# Altium schematic sheet MB_ZBT_memory.SchDoc
size A
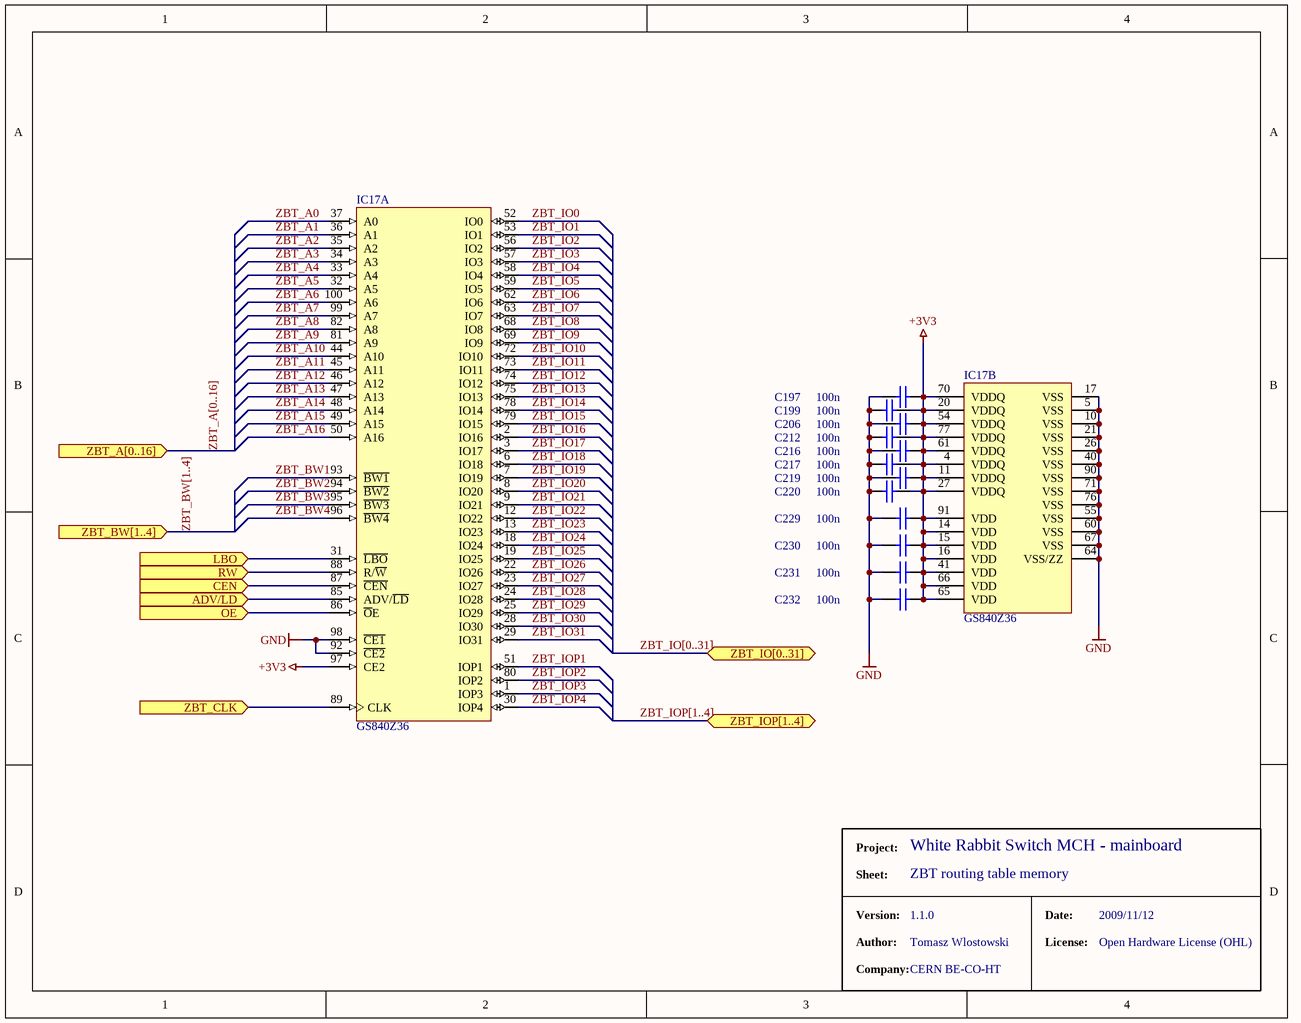
[diagram p0: MB_ZBT_memory.SchDoc]

## Parts
C197  100n  [CAPC1005X55N]
C199  100n  [CAPC1005X55N]
C206  100n  [CAPC1005X55N]
C212  100n  [CAPC1005X55N]
C216  100n  [CAPC1005X55N]
C217  100n  [CAPC1005X55N]
C219  100n  [CAPC1005X55N]
C220  100n  [CAPC1005X55N]
C229  100n  [CAPC1005X55N]
C230  100n  [CAPC1005X55N]
C231  100n  [CAPC1005X55N]
C232  100n  [CAPC1005X55N]
IC17  GS840Z36  [TQFP100A101]  (parts A,B of 2)

## Ports
ADV/LD (in), CEN (in), LBO (in), OE (in), RW (in), ZBT_A[0..16] (in), ZBT_BW[1..4] (in), ZBT_CLK (in), ZBT_IO[0..31] (bidir), ZBT_IOP[1..4] (bidir)

## Nets
+3V3: C197.2 C199.2 C206.2 C212.2 C216.2 C217.2 C219.2 C220.2 C229.2 C230.2 C231.2 C232.2 IC17.4(VDDQ) IC17.11(VDDQ) IC17.14(VDD) IC17.15(VDD) IC17.16(VDD) IC17.20(VDDQ) IC17.27(VDDQ) IC17.41(VDD) IC17.54(VDDQ) IC17.61(VDDQ) IC17.65(VDD) IC17.66(VDD) IC17.70(VDDQ) IC17.77(VDDQ) IC17.91(VDD) IC17.97(CE2)
GND: C197.1 C199.1 C206.1 C212.1 C216.1 C217.1 C219.1 C220.1 C229.1 C230.1 C231.1 C232.1 IC17.5(VSS) IC17.10(VSS) IC17.17(VSS) IC17.21(VSS) IC17.26(VSS) IC17.40(VSS) IC17.55(VSS) IC17.60(VSS) IC17.64(VSS/ZZ) IC17.67(VSS) IC17.71(VSS) IC17.76(VSS) IC17.90(VSS) IC17.92(~{CE2}) IC17.98(~{CE1})
ADV/LD: IC17.85(ADV/~{LD}) ; port ADV/LD
CEN: IC17.87(~{CEN}) ; port CEN
LBO: IC17.31(~{LBO}) ; port LBO
OE: IC17.86(~{O}E) ; port OE
RW: IC17.88(R/~{W}) ; port RW
ZBT_A0: IC17.37(A0)
ZBT_A1: IC17.36(A1)
ZBT_A2: IC17.35(A2)
ZBT_A3: IC17.34(A3)
ZBT_A4: IC17.33(A4)
ZBT_A5: IC17.32(A5)
ZBT_A6: IC17.100(A6)
ZBT_A7: IC17.99(A7)
ZBT_A8: IC17.82(A8)
ZBT_A9: IC17.81(A9)
ZBT_A10: IC17.44(A10)
ZBT_A11: IC17.45(A11)
ZBT_A12: IC17.46(A12)
ZBT_A13: IC17.47(A13)
ZBT_A14: IC17.48(A14)
ZBT_A15: IC17.49(A15)
ZBT_A16: IC17.50(A16)
ZBT_BW1: IC17.93(~{BW1})
ZBT_BW2: IC17.94(~{BW2})
ZBT_BW3: IC17.95(~{BW3})
ZBT_BW4: IC17.96(~{BW4})
ZBT_CLK: IC17.89(CLK) ; port ZBT_CLK
ZBT_IO0: IC17.52(IO0)
ZBT_IO1: IC17.53(IO1)
ZBT_IO2: IC17.56(IO2)
ZBT_IO3: IC17.57(IO3)
ZBT_IO4: IC17.58(IO4)
ZBT_IO5: IC17.59(IO5)
ZBT_IO6: IC17.62(IO6)
ZBT_IO7: IC17.63(IO7)
ZBT_IO8: IC17.68(IO8)
ZBT_IO9: IC17.69(IO9)
ZBT_IO10: IC17.72(IO10)
ZBT_IO11: IC17.73(IO11)
ZBT_IO12: IC17.74(IO12)
ZBT_IO13: IC17.75(IO13)
ZBT_IO14: IC17.78(IO14)
ZBT_IO15: IC17.79(IO15)
ZBT_IO16: IC17.2(IO16)
ZBT_IO17: IC17.3(IO17)
ZBT_IO18: IC17.6(IO18)
ZBT_IO19: IC17.7(IO19)
ZBT_IO20: IC17.8(IO20)
ZBT_IO21: IC17.9(IO21)
ZBT_IO22: IC17.12(IO22)
ZBT_IO23: IC17.13(IO23)
ZBT_IO24: IC17.18(IO24)
ZBT_IO25: IC17.19(IO25)
ZBT_IO26: IC17.22(IO26)
ZBT_IO27: IC17.23(IO27)
ZBT_IO28: IC17.24(IO28)
ZBT_IO29: IC17.25(IO29)
ZBT_IO30: IC17.28(IO30)
ZBT_IO31: IC17.29(IO31)
ZBT_IOP1: IC17.51(IOP1)
ZBT_IOP2: IC17.80(IOP2)
ZBT_IOP3: IC17.1(IOP3)
ZBT_IOP4: IC17.30(IOP4)

## Buses and harness runs
bus ZBT_A[0..16] = port ZBT_A[0..16]
bus ZBT_BW[1..4] = port ZBT_BW[1..4]
bus ZBT_IO[0..31] = port ZBT_IO[0..31]
bus ZBT_IOP[1..4] = port ZBT_IOP[1..4]

## Notes on the sheet
- Project:
- Sheet:
- ZBT routing table memory
- White Rabbit Switch MCH - mainboard
- Version:
- Author:
- Company:
- 1.1.0
- Tomasz Wlostowski
- CERN BE-CO-HT
- Date:
- License:
- 2009/11/12
- Open Hardware License (OHL)

## Library data of the parts
C197 C199 C206 C212 C216 C217 C219 C220 C229-C232 = CC0402_100NF_16V_10%_X7R: Non-polarised capacitor; Part Description: SMD Multilayer Chip Ceramic Capacitor; Manufacturer: GENERIC; Manufacturer1 Part Number: 223878715649; Manufacturer1 Datasheet: \\cern.ch\dfs\Applications\Altium\Datasheets\CC0402_X7R_PHYCOMP.pdf; Value: 100nF; Voltage: 16V; TC: X7R; Tolerance: ±10%; Table: Capacitors SMD; Part Number: CC0402_100NF_16V_10%_X7R; Component Kind: Standard; Component Type: Standard; Designator: Capacitor - non polarized; Library Reference: Capacitor - non polarized; Pin Count: 2; Status: Not Recommended; Manufacturer Part Number: CC0402_100NF_16V_10%_X7R; Case: 0402; Mounted: Yes; Socket: No; SMD: Yes; Manufacturer1 Example: PHYCOMP; Manufacturer1 ComponentHeight: 0.55mm; HelpURL: \\cern.ch\dfs\Applications\Altium\Datasheets\CC0402_X7R_PHYCOMP.pdf; Author: CERN DEM JLC; CreateDate: 12/3/2007; LatestRevisionDate: 12/3/2007
IC17 = 71V3556: 4.5 Mbit ZBT SRAM; RefId: 800-1843-1-ND; Value: IDT71V3556S166PFG8; Supplier: Digikey